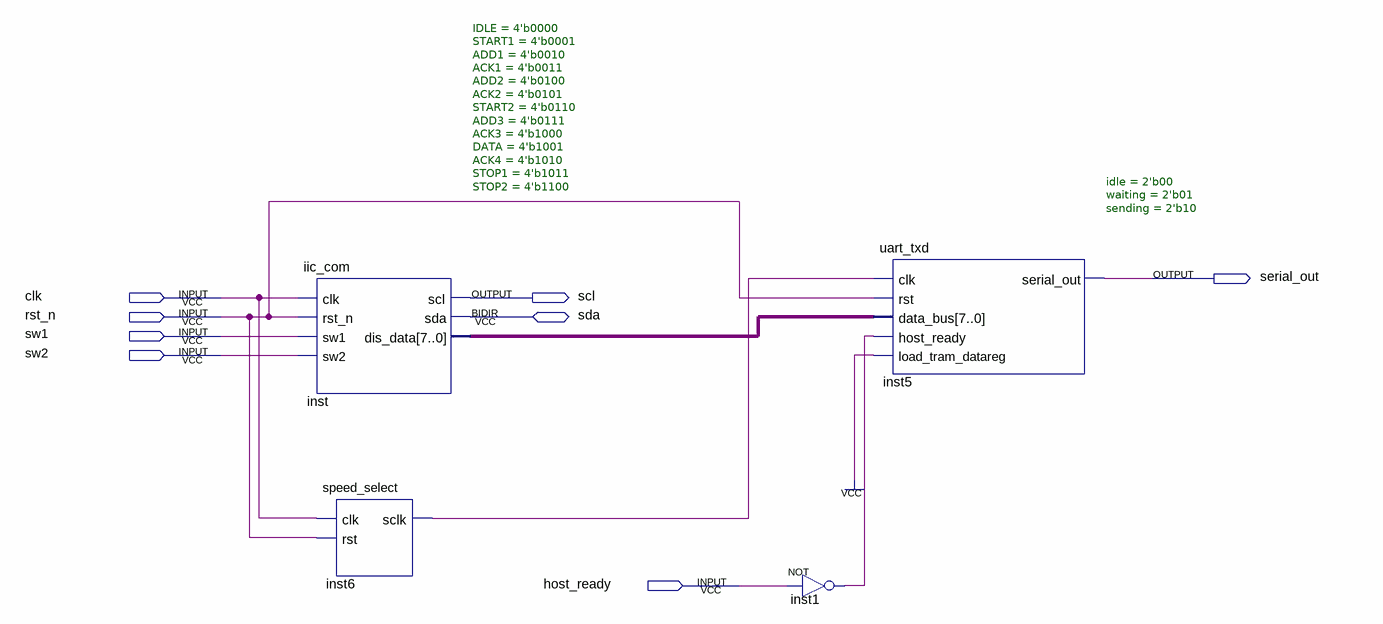
[diagram p0: schematic sheet]
// Quartus schematic Block1.bdf as structural Verilog: 4 symbols, 8 pins
module Block1 (
  input  clk,
  input  rst_n,
  input  sw1,
  input  sw2,
  input  host_ready,
  inout  sda,
  output serial_out,
  output scl
);

  wire inst1_out, inst6_sclk;
  wire [7:0] inst_dis_data;

  iic_com #(.IDLE(4'b0000), .START1(4'b0001), .ADD1(4'b0010), .ACK1(4'b0011), .ADD2(4'b0100), .ACK2(4'b0101), .START2(4'b0110), .ADD3(4'b0111), .ACK3(4'b1000), .DATA(4'b1001), .ACK4(4'b1010), .STOP1(4'b1011), .STOP2(4'b1100)) inst (
    .clk(clk), .rst_n(rst_n), .sw1(sw1), .sw2(sw2), .scl(scl), .dis_data(inst_dis_data), .sda(sda));
  speed_select inst6 (.clk(clk), .rst(rst_n), .sclk(inst6_sclk));
  not inst1 (inst1_out, host_ready);
  uart_txd #(.idle(2'b00), .waiting(2'b01), .sending(2'b10)) inst5 (
    .clk(inst6_sclk), .rst(rst_n), .data_bus(inst_dis_data), .host_ready(inst1_out),
    .load_tram_datareg(1'b1), .serial_out(serial_out));
endmodule
